# Altium schematic sheet TopLayer.SchDoc
size A4
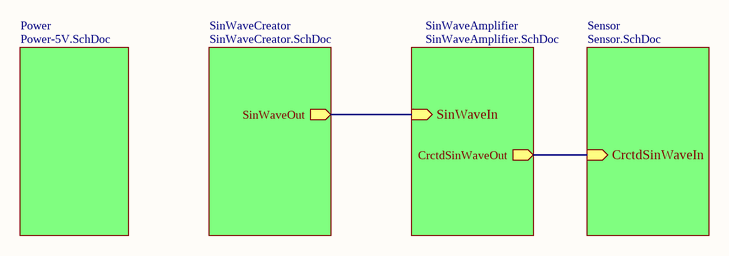
[diagram p0: TopLayer.SchDoc]

## Sub-sheets
Power = Power-5V.SchDoc: no entries
Sensor = Sensor.SchDoc: CrctdSinWaveIn (in)
SinWaveAmplifier = SinWaveAmplifier.SchDoc: SinWaveIn (in), CrctdSinWaveOut (out)
SinWaveCreator = SinWaveCreator.SchDoc: SinWaveOut (out)

## Nets
(unnamed): sheet SinWaveCreator/SinWaveOut, sheet SinWaveAmplifier/SinWaveIn
(unnamed): sheet SinWaveAmplifier/CrctdSinWaveOut, sheet Sensor/CrctdSinWaveIn

## Notes on the sheet
- 图纸大小
- 文件名：
- A4
- 版本号
- 1.0
- 创建日期
- 单位
- 2019/11/28
- HFUT
- 修改日期
- 作者
- XuPeng